# EAGLE design sensor_board012 (EAGLE 5.07)

## Sheet 1 of 2
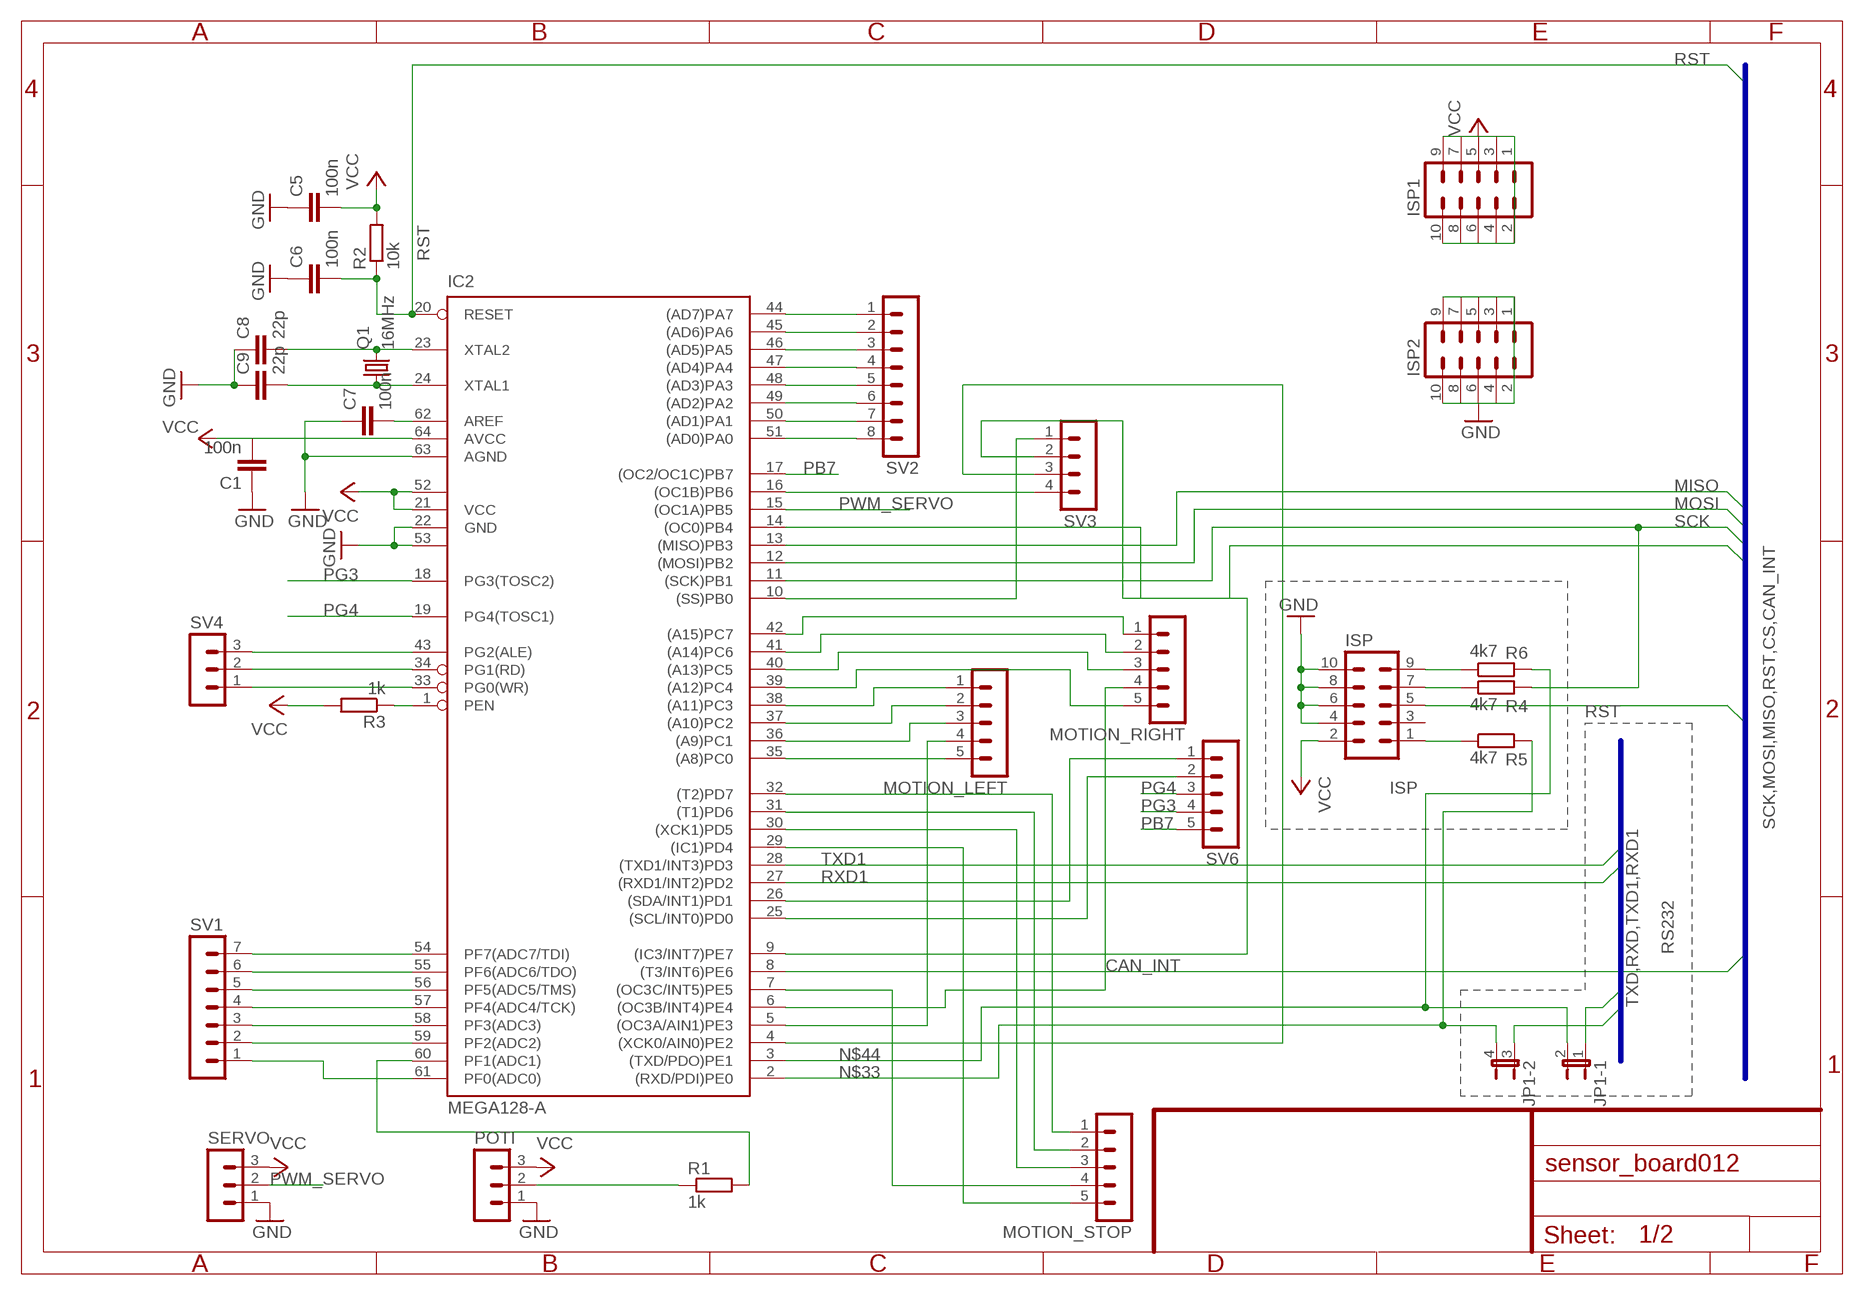
[diagram p0: schematic, sheet 1]

### Parts
C1  100n  C-EUC0603  [C0603]
C5  100n  C-EUC0603  [C0603]
C6  100n  C-EUC0603  [C0603]
C7  100n  C-EUC0603  [C0603]
C8  22p  C-EUC0603  [C0603]
C9  22p  C-EUC0603  [C0603]
IC2  MEGA128-A  [TQFP64]
ISP  MA05-2  [MA05-2]
ISP1  MA05-2  [MA05-2]
ISP2  MA05-2  [MA05-2]
JP1  JP2QE  [JP2Q]
MOTION_LEFT  MA05-1  [MA05-1]
MOTION_RIGHT  MA05-1  [MA05-1]
MOTION_STOP  MA05-1  [MA05-1]
POTI  MA03-1  [MA03-1]
Q1  16MHz  CRYSTALHC49U-V  [HC49U-V]
R1  1k  R-EU_R0805  [R0805]
R2  10k  R-EU_R0805  [R0805]
R3  1k  R-EU_R0805  [R0805]
R4  4k7  R-EU_R0805  [R0805]
R5  4k7  R-EU_R0805  [R0805]
R6  4k7  R-EU_R0805  [R0805]
SERVO  MA03-1  [MA03-1]
SV1  MA07-1  [MA07-1]
SV2  MA08-1  [MA08-1]
SV3  MA04-1  [MA04-1]
SV4  MA03-1  [MA03-1]
SV6  MA05-1  [MA05-1]

### Nets
CAN_INT: IC2.8((T3/INT6)PE6) ; also sheet 2
CS: IC2.14((OC0)PB4) ; also sheet 2
GND: C1.1 C5.1 C6.1 C7.1 C8.1 C9.1 IC2.22(GND) IC2.53(GND1) IC2.63(AGND) ISP2.1 ISP2.2 ISP2.3 ISP2.4 ISP2.5 ISP2.6 ISP2.7 ISP2.8 ISP2.9 ISP2.10 ISP.4 ISP.6 ISP.8 ISP.10 POTI.1 SERVO.1 ; also sheet 2
MISO: IC2.13((MISO)PB3) ; also sheet 2
MOSI: IC2.12((MOSI)PB2) ; also sheet 2
N$1: IC2.54(PF7(ADC7/TDI)) SV1.7
N$3: IC2.35((A8)PC0) MOTION_LEFT.5
N$4: IC2.36((A9)PC1) MOTION_LEFT.3
N$5: C7.2 IC2.62(AREF)
N$6: C9.2 IC2.24(XTAL1) Q1.1
N$7: C8.2 IC2.23(XTAL2) Q1.2
N$9: IC2.37((A10)PC2) MOTION_LEFT.2
N$11: IC2.38((A11)PC3) MOTION_LEFT.1
N$12: IC2.5((OC3A/AIN1)PE3) MOTION_LEFT.4
N$13: IC2.9((IC3/INT7)PE7) SV3.2
N$14: IC2.39((A12)PC4) MOTION_RIGHT.5
N$15: IC2.42((A15)PC7) MOTION_RIGHT.1
N$19: IC2.7((OC3C/INT5)PE5) MOTION_STOP.4
N$20: IC2.44((AD7)PA7) SV2.1
N$22: ISP.9 R6.1
N$24: IC2.45((AD6)PA6) SV2.2
N$25: ISP.1 R5.1
N$26: IC2.1(PEN) R3.1
N$28: IC2.46((AD5)PA5) SV2.3
N$29: ISP.7 R4.1
N$31: IC2.47((AD4)PA4) SV2.4
N$32: IC2.48((AD3)PA3) SV2.5
N$33: IC2.2((RXD/PDI)PE0) JP1.4 R5.2
N$34: IC2.49((AD2)PA2) SV2.6
N$35: IC2.50((AD1)PA1) SV2.7
N$42: IC2.40((A13)PC5) MOTION_RIGHT.3
N$44: IC2.3((TXD/PDO)PE1) JP1.2 R6.2
N$47: IC2.51((AD0)PA0) SV2.8
N$52: IC2.41((A14)PC6) MOTION_RIGHT.2
N$57: IC2.29((IC1)PD4) MOTION_STOP.5
N$58: IC2.55(PF6(ADC6/TDO)) SV1.6
N$60: IC2.56(PF5(ADC5/TMS)) SV1.5
N$61: IC2.25((SCL/INT0)PD0) SV6.2
N$62: IC2.26((SDA/INT1)PD1) SV6.1
N$63: IC2.57(PF4(ADC4/TCK)) SV1.4
N$64: IC2.30((XCK1)PD5) MOTION_STOP.3
N$65: IC2.31((T1)PD6) MOTION_STOP.2
N$66: IC2.32((T2)PD7) MOTION_STOP.1
N$67: IC2.58(PF3(ADC3)) SV1.3
N$68: IC2.59(PF2(ADC2)) SV1.2
N$69: IC2.61(PF0(ADC0)) SV1.1
N$70: IC2.60(PF1(ADC1)) R1.2
N$71: IC2.16((OC1B)PB6) SV3.4
N$72: IC2.10((SS)PB0) SV3.1
N$73: POTI.2 R1.1
N$76: IC2.4((XCK0/AIN0)PE2) SV3.3
N$79: IC2.43(PG2(ALE)) SV4.3
N$80: IC2.34(PG1(RD)) SV4.2
N$81: IC2.33(PG0(WR)) SV4.1
N$82: IC2.6((OC3B/INT4)PE4) MOTION_RIGHT.4
PB7: IC2.17((OC2/OC1C)PB7) SV6.5
PG3: IC2.18(PG3(TOSC2)) SV6.4
PG4: IC2.19(PG4(TOSC1)) SV6.3
PWM_SERVO: IC2.15((OC1A)PB5) SERVO.2
RST: C6.2 IC2.20(RESET) ISP.5 R2.1 ; also sheet 2
RXD: JP1.3 ; also sheet 2
RXD1: IC2.27((RXD1/INT2)PD2) ; also sheet 2
SCK: IC2.11((SCK)PB1) R4.2 ; also sheet 2
TXD: JP1.1 ; also sheet 2
TXD1: IC2.28((TXD1/INT3)PD3) ; also sheet 2
VCC: C1.2 C5.2 IC2.21(VCC) IC2.52(VCC1) IC2.64(AVCC) ISP1.1 ISP1.2 ISP1.3 ISP1.4 ISP1.5 ISP1.6 ISP1.7 ISP1.8 ISP1.9 ISP1.10 ISP.2 POTI.3 R2.2 R3.2 SERVO.3 ; also sheet 2
Unconnected: ISP.3

### Buses
SCK,MOSI,MISO,RST,CS,CAN_INT
TXD,RXD,TXD1,RXD1

### Notes on the sheet
- ISP
- RS232

## Sheet 2 of 2
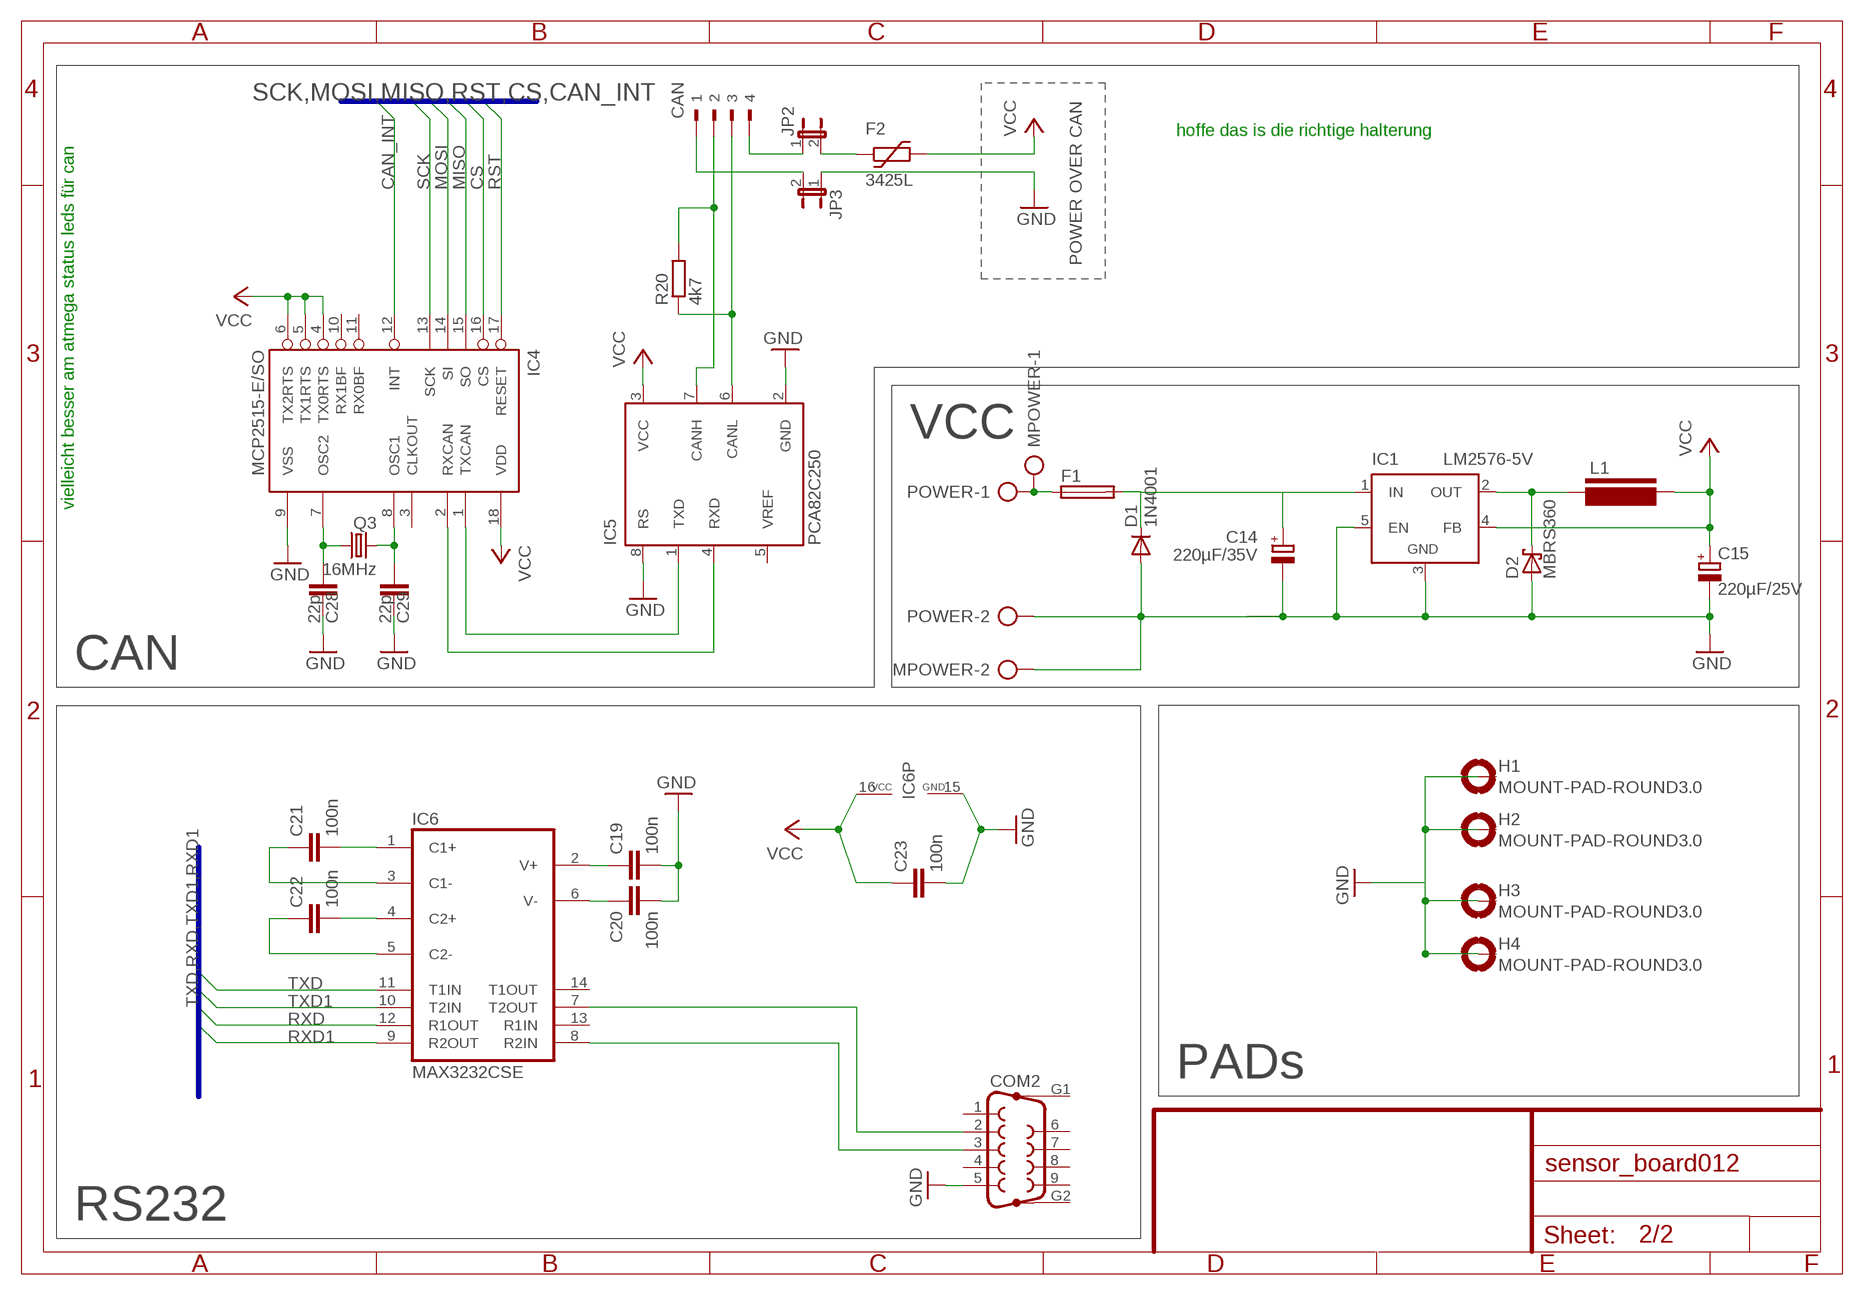
[diagram p1: schematic, sheet 2]

### Parts
C14  220µF/35V  CPOL-EUE5-10.5  [E5-10,5]
C15  220µF/25V  CPOL-EUE3.5-10  [E3,5-10]
C19  100n  C-EUC0603  [C0603]
C20  100n  C-EUC0603  [C0603]
C21  100n  C-EUC0603  [C0603]
C22  100n  C-EUC0603  [C0603]
C23  100n  C-EUC0603  [C0603]
C28  22p  C-EUC0603  [C0603]
C29  22p  C-EUC0603  [C0603]
CAN  90-4  [90-4]
COM2  F09HP  [F09HP]
D1  1N4001  1N4004  [DO41-10]
D2  MBRS360  SCHOTTKY-DIODESMC  [SMC]
F1  SH22,5A  [SH22,5A]
F2  3425L  [3425L]
H1  MOUNT-PAD-ROUND3.0  [3,0-PAD]
H2  MOUNT-PAD-ROUND3.0  [3,0-PAD]
H3  MOUNT-PAD-ROUND3.0  [3,0-PAD]
H4  MOUNT-PAD-ROUND3.0  [3,0-PAD]
IC1  LM2576-5V  LM2596TV  [TO220-51]
IC4  MCP2515-E/SO  [SO18L]
IC5  PCA82C250  [DIL08]
IC6  MAX3232CSE  [SO16]
JP2  JP1E  [JP1]
JP3  JP1E  [JP1]
L1  L-PISR  [PISR]
MPOWER  AK500/2-H  [AK500/2-H]
POWER  AK500/2-H  [AK500/2-H]
Q3  16MHz  CRYSTALHC49U-V  [HC49U-V]
R20  4k7  R-EU_R0805  [R0805]

### Nets
CAN_INT: IC4.12(INT) ; also sheet 1
CS: IC4.16(CS) ; also sheet 1
GND: C14.- C15.- C19.2 C20.2 C23.2 C28.2 C29.2 COM2.5 D1.A D2.A H1.B3,0(MOUNT) H2.B3,0(MOUNT) H3.B3,0(MOUNT) H4.B3,0(MOUNT) IC1.3(GND) IC1.5(EN) IC4.9(VSS) IC5.2(GND) IC5.8(RS) IC6.15(GND) JP3.1 MPOWER.2 POWER.2 ; also sheet 1
MISO: IC4.15(SO) ; also sheet 1
MOSI: IC4.14(SI) ; also sheet 1
N$2: IC4.1(TXCAN) IC5.1(TXD)
N$8 [Power]: D2.C IC1.2(OUT) L1.P$1
N$10 [Power]: F1.1 MPOWER.1 POWER.1
N$16: CAN.4 JP2.1
N$17: C21.2 IC6.1(C1+)
N$21: IC4.2(RXCAN) IC5.4(RXD)
N$23: CAN.3 IC5.6(CANL) R20.1
N$30: C22.2 IC6.4(C2+)
N$36: C22.1 IC6.5(C2-)
N$37: C21.1 IC6.3(C1-)
N$40: COM2.2 IC6.7(T2OUT)
N$41: COM2.3 IC6.8(R2IN)
N$43: C19.1 IC6.2(V+)
N$46: C20.1 IC6.6(V-)
N$49: F2.P$1 JP2.2
N$50: CAN.1 JP3.2
N$53: C28.1 IC4.7(OSC2) Q3.1
N$54: C29.1 IC4.8(OSC1) Q3.2
N$56 [Power]: C14.+ D1.C F1.2 IC1.1(IN)
N$59: CAN.2 IC5.7(CANH) R20.2
RST: IC4.17(RESET) ; also sheet 1
RXD: IC6.12(R1OUT) ; also sheet 1
RXD1: IC6.9(R2OUT) ; also sheet 1
SCK: IC4.13(SCK) ; also sheet 1
TXD: IC6.11(T1IN) ; also sheet 1
TXD1: IC6.10(T2IN) ; also sheet 1
VCC: C15.+ C23.1 F2.P$2 IC1.4(FB) IC4.4(TX0RTS) IC4.5(TX1RTS) IC4.6(TX2RTS) IC4.18(VDD) IC5.3(VCC) IC6.16(VCC) L1.P$2 ; also sheet 1
Unconnected: COM2.1 COM2.4 COM2.6 COM2.7 COM2.8 COM2.9 COM2.G1 COM2.G2 IC4.3(CLKOUT) IC4.10(RX1BF) IC4.11(RX0BF) IC5.5(VREF) IC6.13(R1IN) IC6.14(T1OUT)

### Buses
SCK,MOSI,MISO,RST,CS,CAN_INT
TXD,RXD,TXD1,RXD1

### Notes on the sheet
- POWER OVER CAN
- hoffe das is die richtige halterung
- VCC
- vielleicht besser am atmega status leds für can
- CAN
- PADs
- RS232

## Library data of the parts
C1 C5-C9 C19-C23 C28 C29 = rcl:C-EU: CAPACITOR, European symbol
C14 C15 = rcl:CPOL-EU: POLARIZED CAPACITOR, European symbol
CAN = con-weidmueller-sl35:90-4: WEIDMUELLER CLAMP CONNECTOR
COM2 = con-subd:F09HP: SUB-D
D1 = diode:1N4004: DIODE general purpose rectifier, 1 A
D2 = diode:SCHOTTKY-DIODE: Schottky Diode
F1 = fuse:SH22,5A: FUSE HOLDER grid 22,5mm, isolated cap OGN0031 8201, Schurter (Buerklin)
F2 = ptc-littlefuse:3425L
H1-H4 = holes:MOUNT-PAD-ROUND: MOUNTING PAD, round
IC1 = linear:LM2596T: STEP-DOWN VOLTAGE REGULATOR
IC2 = atmel:MEGA128: MICROCONTROLLER 128 Kbytes FLASH 4 Kbytes SRAM 4 Kbytes EEPROM DUAL USART 8-channel 10 bit ADC Source: avr.lbr
IC4 = mcp2515:MCP2515
IC5 = micro-philips:PCA82C250: CAN CONTROLLER INTERFACE
IC6 = maxim:MAX3232*: True RS-232 Transceivers 3.0V to 5.5V, Low-Power up to 1Mbps, Using Four 0.1µF External Capacitors Source: http://pdfserv.maxim-ic.com/en/ds/MAX3222-MAX3241.pdf
ISP ISP1 ISP2 = con-lstb:MA05-2: PIN HEADER
JP1 = jumper:JP2QE: JUMPER
JP2 JP3 = jumper:JP1E: JUMPER
L1 = L-PISR:L-PISR: Fastron SMD Power Inductors (also Shielded) - PISR Series Data Sheet <http://www.fastrongroup.com/products/inductors/pdf/PISR.pdf> Part No Inductance L (µH) fL (MHz) Tol ± (%) SRF min (MHz) DCR max (Ω) Rated DC Current | sat (A) | Δ T = 40°C (A) PISR-1R0M-04 1.0 0.1 20 164 0.009 21 8.60 PISR-2R2M-04 2.2 0.1 20 95 0.014 16 7.10 PISR-3R3M-04 3.3 0.1 20 72 0.017 15 6.40 PISR-4R7M-04 4.7 0.1 20 52 0.019 13 5.80 PISR-5R6M-04 5.6 0.1 20 41 0.022 12 5.50 PISR-6R8M-04 6.8 0.1 20 35 0.024 11 5.20 PISR-100M-04 10 0.1 20 24 0.029 10 4.50 PISR-150M-04 15 0.1 20 20 0.035 8.0 4.10 PISR-220M-04 22 0.1 20 15 0.04 7.0 3.60 PISR-330M-04 33 0.1 20 10 0.06 5.6 3.10 PISR-470M-04 47 0.1 20 8 0.07 4.6 2.70 PISR-680M-04 68 0.1 20 6.5 0.10 3.6 2.30 PISR-101M-04 100 0.1 20 5.2 0.17 3.1 1.90 PISR-151M-04 150 0.1 20 4.2 0.22 2.6 1.60 PISR-221M-04 220 0.1 20 3.3 0.34 2.2 1.30 PISR-331M-04 330 0.1 20 2.7 0.52 1.9 1.10 PISR-471M-04 470 0.1 20 2.1 0.76 1.4 0.85 PISR-681M-04 680 0.1 20 1.8 1.1 1.2 0.74 PISR-102M-04 1000 0.1 20 1.3 1.7 1.0 0.57
MOTION_LEFT MOTION_RIGHT MOTION_STOP SV6 = con-lstb:MA05-1: PIN HEADER
MPOWER POWER = con-ptr500:AK500/2-H: CONNECTOR Aug. 2004 / PTR Meßtechnik: Die Bezeichnung der Serie AK505 wurde geändert. Es handelt sich hierbei um AK500 in horizontaler Ausführung.
POTI SERVO SV4 = con-lstb:MA03-1: PIN HEADER
Q1 Q3 = crystal:CRYSTAL: CRYSTAL
R1-R6 R20 = rcl:R-EU_: RESISTOR, European symbol
SV1 = con-lstb:MA07-1: PIN HEADER
SV2 = con-lstb:MA08-1: PIN HEADER
SV3 = con-lstb:MA04-1: PIN HEADER

## Net classes
1 Power: width 0.406 mm

## Board
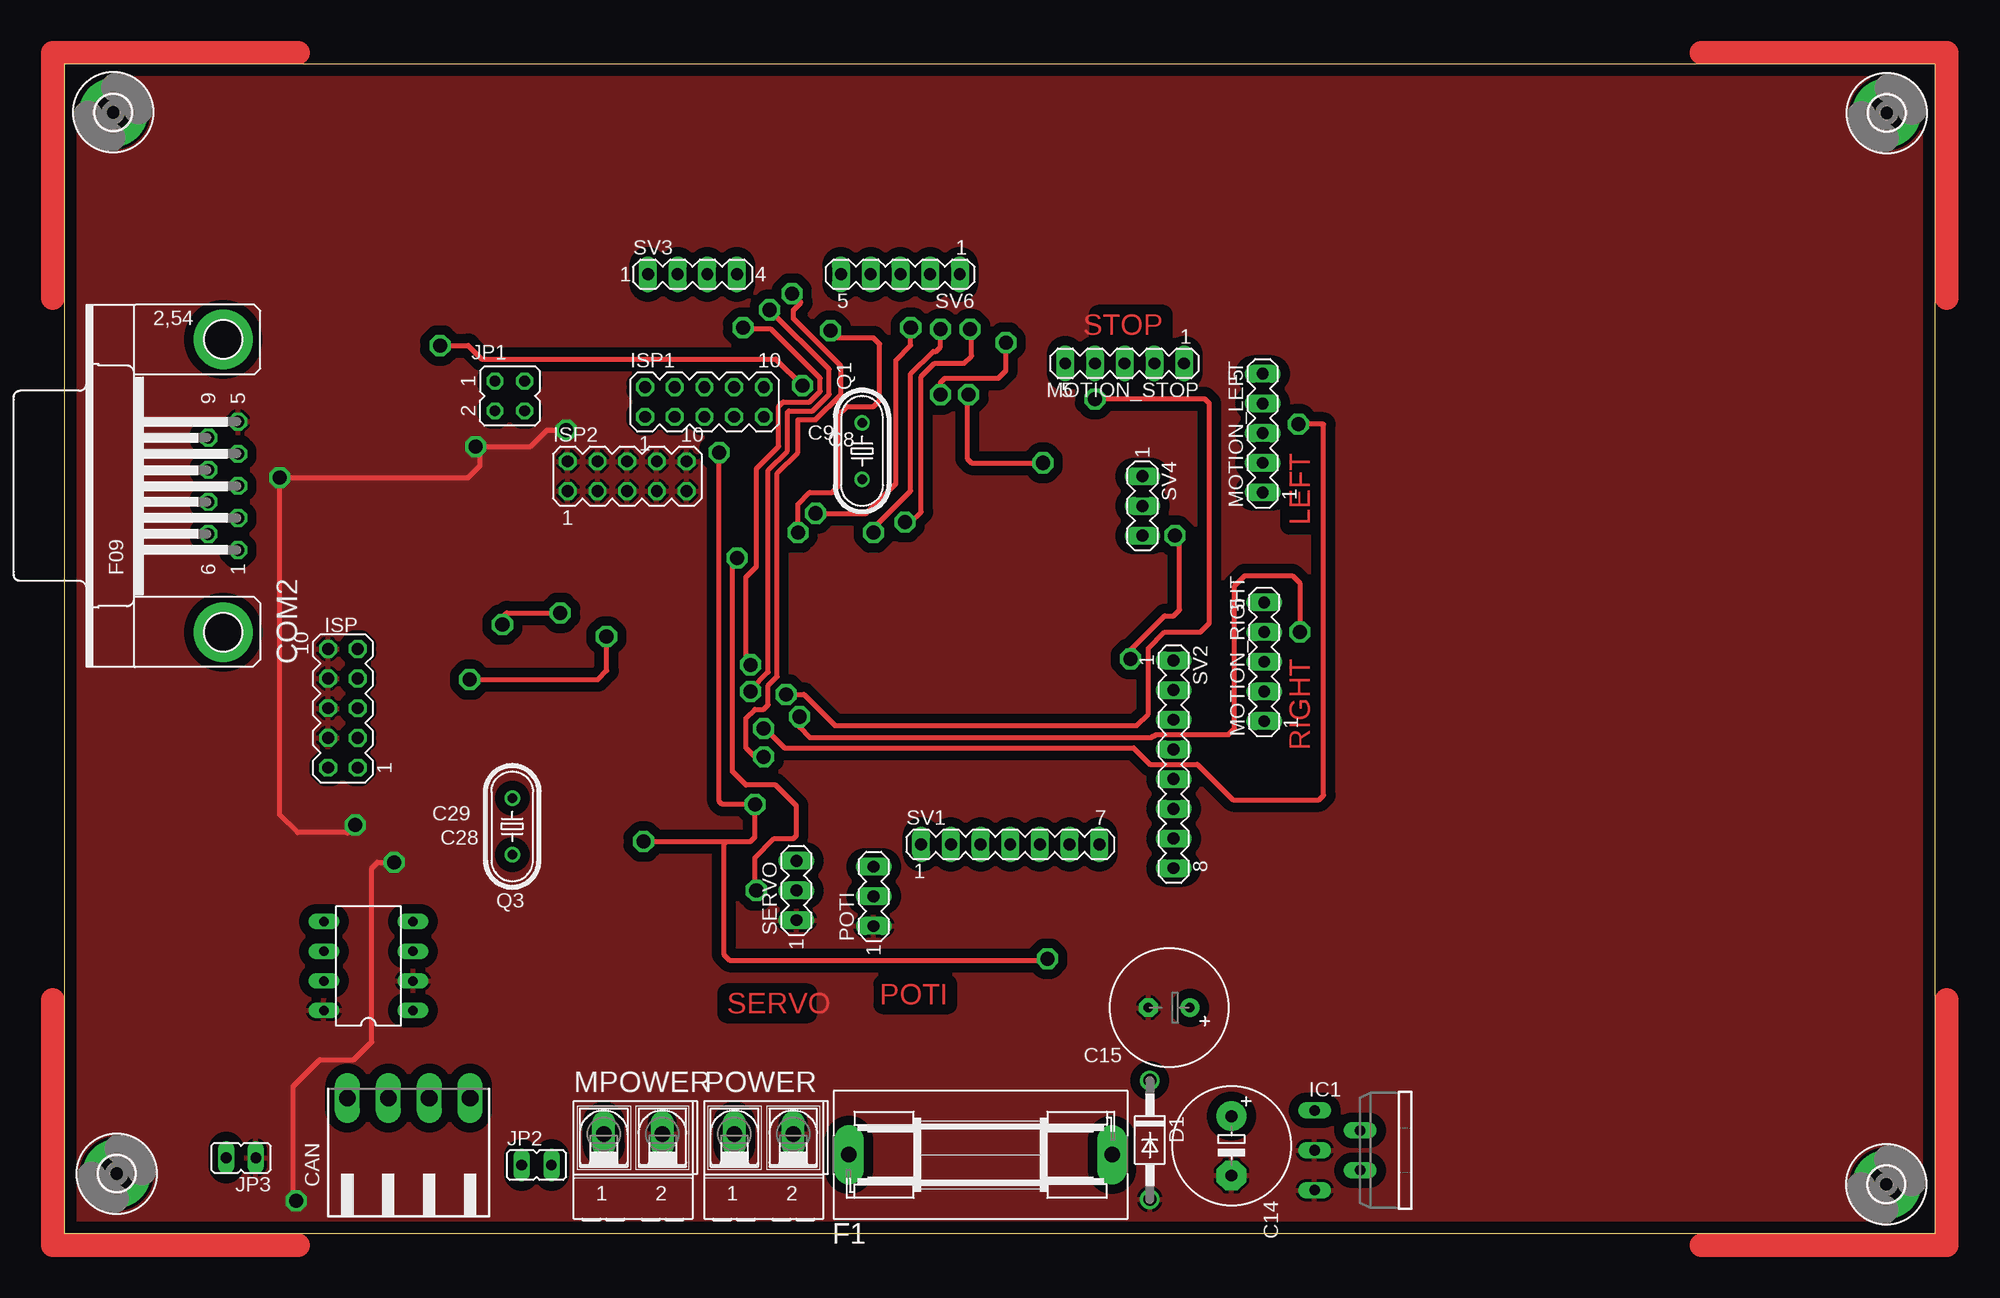
[diagram p2: board, top side]
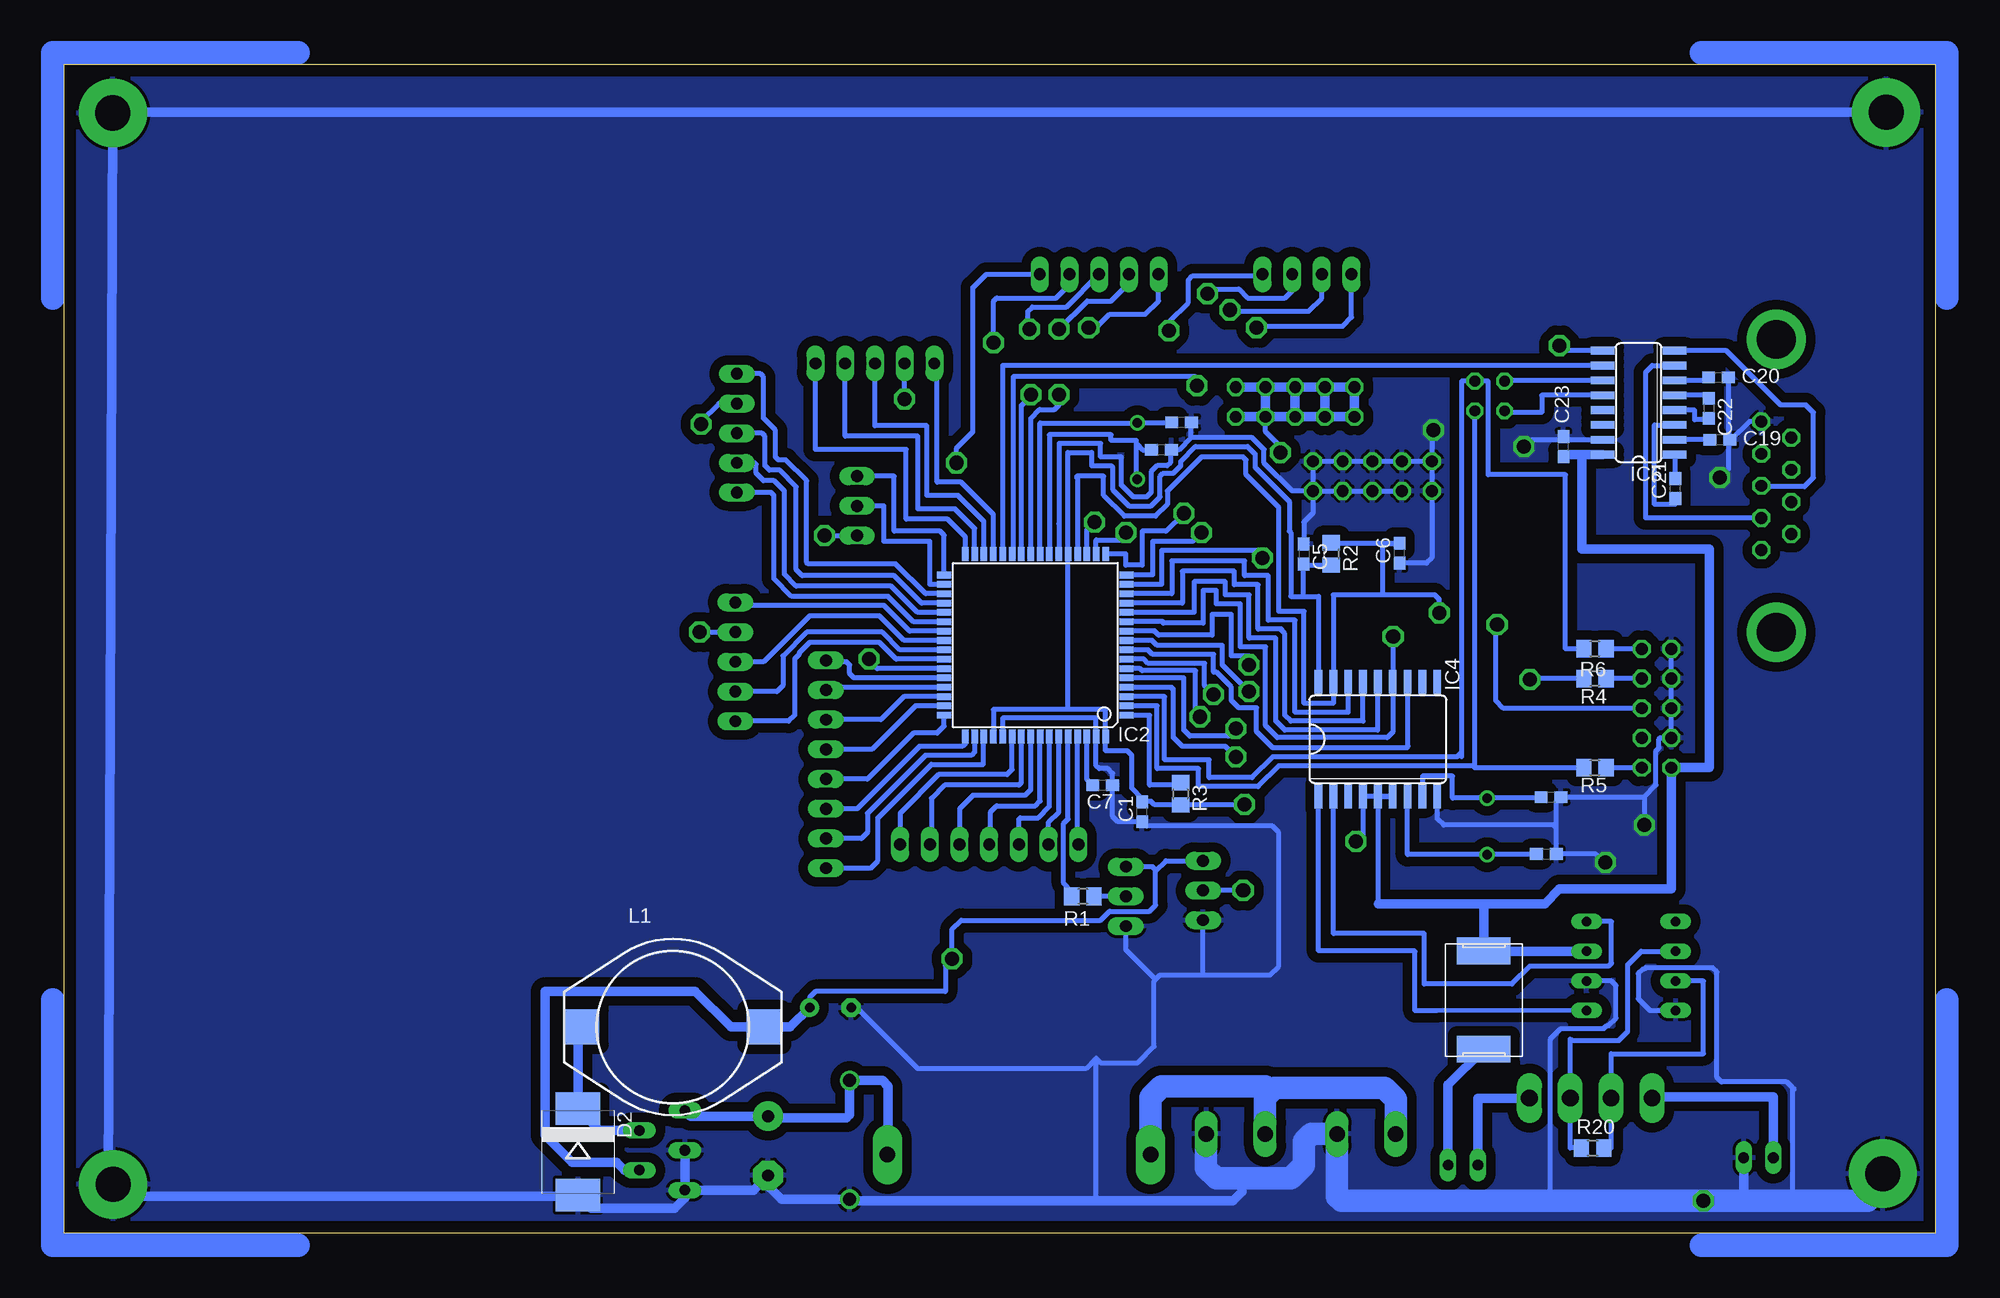
[diagram p3: board, bottom side, seen from below]

Size 160 x 100 mm. Coordinates in mm from the lower left corner, seen from the top.
Outline: 0,0 160,0 160,100 0,100 0,0
Copper layers (1*16): Top 0.035mm / dielectric 1.5mm / Bottom 0.035mm
Design rules "default": minimum track width 10mil, minimum drill 24mil, track to track 8mil, track to pad 8mil, pad to pad 8mil, via to via 8mil, smd to smd 8mil, copper to edge 40mil, drill to drill 8mil, minimum pad ring 10mil, minimum via ring 8mil, stop-mask expansion 4mil, vias tented up to drill 0mil, thermal gap 10mil

### Footprints (pad centres in the part's own frame; a part is rotated, then mirrored left to right if it is on the bottom)
C0603 = smd 1.1 x 1: 1 -0.85,0; 2 0.85,0
E5-10,5 = drill 1.016 pad 2.54 round: + -2.54,0 | drill 1.016 pad 2.54 octagon: - 2.54,0
E3,5-10 = drill 0.813 pad 1.6 round: + -1.778,0 | drill 0.813 pad 1.6 octagon: - 1.778,0
90-4 = drill 1.422 long: 1 -5.25,5.25; 2 -1.75,5.25; 3 1.75,5.25; 4 5.25,5.25
F09HP = drill 1.016 octagon: 1 -5.486,-1.27; 2 -2.743,-1.27; 3 0,-1.27; 4 2.743,-1.27; 5 5.486,-1.27; 6 -4.115,1.27; 7 -1.372,1.27; 8 1.372,1.27; 9 4.115,1.27 | drill 3.302 pad 5.08 round: G1 -12.522,0; G2 12.522,0
DO41-10 = drill 1.118 round: A 5.08,0; C -5.08,0
SMC = smd 2.8 x 3.8: A 3.7,0; C -3.7,0
SH22,5A = drill 1.321 pad 2.54 long: 1 -11.252,0; 2 11.252,0
3425L = smd 2.29 x 4.57: P$1 -4.2,0; P$2 4.2,0
3,0-PAD = drill 3 pad 5.842 round: B3,0 0,0
TO220-51 = drill 0.9 long: 1 -3.4,-8.4; 2 -1.7,-4.5; 3 0,-8.4; 4 1.7,-4.5; 5 3.4,-8.4
TQFP64 = smd 1.194 x 0.559: 1 -7.8,6; 2 -7.8,5.2; 3 -7.8,4.4; 4 -7.8,3.6; 5 -7.8,2.8; 6 -7.8,2; 7 -7.8,1.2; 8 -7.8,0.4; 9 -7.8,-0.4; 10 -7.8,-1.2; 11 -7.8,-2; 12 -7.8,-2.8; 13 -7.8,-3.6; 14 -7.8,-4.4; 15 -7.8,-5.2; 16 -7.8,-6; 33 7.8,-6; 34 7.8,-5.2; 35 7.8,-4.4; 36 7.8,-3.6; 37 7.8,-2.8; 38 7.8,-2; 39 7.8,-1.2; 40 7.8,-0.4; 41 7.8,0.4; 42 7.8,1.2; 43 7.8,2; 44 7.8,2.8; 45 7.8,3.6; 46 7.8,4.4; 47 7.8,5.2; 48 7.8,6 | smd 0.559 x 1.194: 17 -6,-7.8; 18 -5.2,-7.8; 19 -4.4,-7.8; 20 -3.6,-7.8; 21 -2.8,-7.8; 22 -2,-7.8; 23 -1.2,-7.8; 24 -0.4,-7.8; 25 0.4,-7.8; 26 1.2,-7.8; 27 2,-7.8; 28 2.8,-7.8; 29 3.6,-7.8; 30 4.4,-7.8; 31 5.2,-7.8; 32 6,-7.8; 49 6,7.8; 50 5.2,7.8; 51 4.4,7.8; 52 3.6,7.8; 53 2.8,7.8; 54 2,7.8; 55 1.2,7.8; 56 0.4,7.8; 57 -0.4,7.8; 58 -1.2,7.8; 59 -2,7.8; 60 -2.8,7.8; 61 -3.6,7.8; 62 -4.4,7.8; 63 -5.2,7.8; 64 -6,7.8
SO18L = smd 0.66 x 2.032: 1 -5.08,-4.902; 2 -3.81,-4.902; 3 -2.54,-4.902; 4 -1.27,-4.902; 5 0,-4.902; 6 1.27,-4.902; 7 2.54,-4.902; 8 3.81,-4.902; 9 5.08,-4.902; 10 5.08,4.902; 11 3.81,4.902; 12 2.54,4.902; 13 1.27,4.902; 14 0,4.902; 15 -1.27,4.902; 16 -2.54,4.902; 17 -3.81,4.902; 18 -5.08,4.902
DIL08 = drill 0.813 long: 1 -3.81,-3.81; 2 -1.27,-3.81; 3 1.27,-3.81; 4 3.81,-3.81; 5 3.81,3.81; 6 1.27,3.81; 7 -1.27,3.81; 8 -3.81,3.81
SO16 = smd 0.66 x 2.032: 1 -4.445,-3.073; 2 -3.175,-3.073; 3 -1.905,-3.073; 4 -0.635,-3.073; 5 0.635,-3.073; 6 1.905,-3.073; 7 3.175,-3.073; 8 4.445,-3.073; 9 4.445,3.073; 10 3.175,3.073; 11 1.905,3.073; 12 0.635,3.073; 13 -0.635,3.073; 14 -1.905,3.073; 15 -3.175,3.073; 16 -4.445,3.073
MA05-2 = drill 1.016 octagon: 1 -5.08,-1.27; 2 -5.08,1.27; 3 -2.54,-1.27; 4 -2.54,1.27; 5 0,-1.27; 6 0,1.27; 7 2.54,-1.27; 8 2.54,1.27; 9 5.08,-1.27; 10 5.08,1.27
JP2Q = drill 0.914 octagon: 1 -1.27,-1.27; 2 -1.27,1.27; 3 1.27,-1.27; 4 1.27,1.27
JP1 = drill 0.914 long: 1 0,-1.27; 2 0,1.27
PISR = smd 3 x 3: P$1 -7.8,0; P$2 7.8,0
MA05-1 = drill 1.016 long: 1 -5.08,0; 2 -2.54,0; 3 0,0; 4 2.54,0; 5 5.08,0
AK500/2-H = drill 1.321 long: 1 -2.515,0; 2 2.515,0
MA03-1 = drill 1.016 long: 1 -2.54,0; 2 0,0; 3 2.54,0
HC49U-V = drill 0.813 round: 1 -2.413,0; 2 2.413,0
R0805 = smd 1.3 x 1.5: 1 -0.95,0; 2 0.95,0
MA07-1 = drill 1.016 long: 1 -7.62,0; 2 -5.08,0; 3 -2.54,0; 4 0,0; 5 2.54,0; 6 5.08,0; 7 7.62,0
MA08-1 = drill 1.016 long: 1 -8.89,0; 2 -6.35,0; 3 -3.81,0; 4 -1.27,0; 5 1.27,0; 6 3.81,0; 7 6.35,0; 8 8.89,0
MA04-1 = drill 1.016 long: 1 -3.81,0; 2 -1.27,0; 3 1.27,0; 4 3.81,0

### Placement (x,y rotation side)
C1  67.82,36.07 90 bottom
C5  54,58.12 270 bottom
C6  45.81,58.18 90 bottom
C7  71.2,38.33 180 bottom
C8  66.18,67.02 180 bottom
C9  64.44,69.38 180 bottom
C14  99.82,7.49 270 top
C15  94.49,19.3 180 top
C19  18.41,67.88 0 bottom
C20  18.53,73.22 0 bottom
C21  22.23,63.72 90 bottom
C22  19.37,70.57 270 bottom
C23  31.79,67.31 90 bottom
C28  33.25,32.46 0 bottom
C29  32.85,37.33 0 bottom
CAN  29.45,6.32 0 top
COM2  13.59,63.94 90 top
D1  92.84,8 270 top
D2  116.08,6.99 270 bottom
F1  78.36,6.73 0 top
F2  38.61,19.96 90 bottom
H1  4.48,5.12 0 top
H2  155.85,95.84 0 top
H3  155.83,4.19 0 top
H4  4.19,95.89 0 top
IC1  115.32,7.11 270 top
IC2  76.95,50.32 180 bottom
IC4  47.66,42.28 0 bottom
IC5  26.01,22.87 90 top
IC6  25.36,71.06 90 bottom
ISP  23.83,44.92 90 top
ISP1  54.74,71.12 0 top
ISP2  48.13,64.77 0 top
JP1  38.1,71.63 270 top
JP2  40.39,5.84 270 top
JP3  15.11,6.48 90 top
L1  107.95,17.65 0 bottom
MOTION_LEFT  102.49,68.45 90 top
MOTION_RIGHT  102.62,48.9 90 top
MOTION_STOP  90.68,74.42 180 top
MPOWER  48.64,8.51 0 top
POTI  69.22,28.83 90 top
POWER  59.82,8.51 0 top
Q1  68.22,66.92 270 top
Q3  38.3,34.82 90 top
R1  72.9,28.83 180 bottom
R2  51.65,58.12 270 bottom
R3  64.54,37.6 270 bottom
R4  29.1,47.45 180 bottom
R5  29.1,39.83 180 bottom
R6  29.1,50 180 bottom
R20  29.3,7.32 0 bottom
SERVO  62.61,29.34 90 top
SV1  80.9,33.27 0 top
SV2  94.87,40.13 270 top
SV3  53.72,82.04 0 top
SV4  92.2,62.23 270 top
SV6  71.5,82.04 180 top

### Tracks (layer width: path | path; a pad name or v marks a point on that pad's centre or on a via)
CAN_INT
  Bottom 0.406: IC4.12 45.09,47.18 45.09,41.66 45.21,41.53 56.64,41.53 56.77,41.66 57.02,41.91 58.04,42.93 58.04,44.96 59.56,44.96 60.2,45.59 60.2,46.74 61.47,48.01 61.72,48.01 61.72,49.53 66.93,49.53 67.32,49.92 IC2.8
CS
  Bottom 0.406: IC4.16 50.2,44.58 54.74,44.58 54.74,52.45 57.02,52.45 57.02,56.26 59.05,56.26 59.05,57.53 65.28,57.53 65.28,54.72 IC2.14
GND  (via drill 1.2, 1.2 pad 1.78)
  Top 0.406: v24.89,34.92 24.19,34.23 24.13,34.29 19.94,34.29 18.41,35.81 v18.41,64.64 34.54,64.64 35.56,65.66 35.56,66.93 v35.18,67.31 39.88,67.31 41.27,68.71 v42.93,68.71 | v28.19,31.75 26.8,31.75 26.29,31.24 26.29,16.38 24.77,14.86 21.84,14.86 19.56,12.57 19.56,3.05 v19.81,2.79
  Bottom 0.406: C20.2 17.65,73.22 17.65,67.88 | 17.65,67.88 C19.2 17.46,67.88 15.88,69.47 14.9,69.47 COM2.5 | C23.2 31.75,68.16 31.75,67.88 | 31.75,67.88 IC6.15 | C5.1 54,60.83 53.21,61.62 ISP2.9 | IC2.22 74.95,60.69 74.93,60.69 74.93,67.56 71.37,67.56 71.37,66.42 69.6,66.42 69.6,64.01 68.58,62.99 67.44,62.99 67.06,63.37 67.06,65.15 66.55,65.66 65.66,65.66 65.41,65.91 65.41,66.94 C8.1 64.68,67.02 63.63,68.07 | IC2.53 79.76,44.07 71.75,44.07 IC2.63 71.75,40.01 71.5,39.75 70.74,39.75 70.35,39.36 C7.1 70.36,38.32 70.36,35.69 69.89,35.22 C1.1 67.44,34.84 56.68,34.84 56.13,34.29 56.13,22.86 56.9,22.1 62.61,22.1 | C15.- 92.2,19.3 87,14.1 72.64,14.1 71.75,14.99 | IC5.8 24.4,19.06 25.4,20.07 25.4,22.23 25.02,22.61 24.89,22.61 24.77,22.73 19.05,22.73 18.67,22.35 18.67,13.34 18.29,12.95 12.7,12.95 12.19,12.45 | 12.19,12.45 12.19,2.92 12.32,2.79 | 32.4,34.67 32.4,36.93 C29.2 24.89,37.34 | 32.4,34.67 C28.2 29.03,32.46 28.32,31.75 v28.19,31.75 | 71.75,14.99 71.75,3.17 72.14,2.79 | 62.61,22.1 66.29,22.1 66.67,21.72 | 66.67,21.72 66.8,21.59 66.8,16 68.2,14.61 71.37,14.61 71.75,14.99 | ISP2.2 ISP2.1 43.05,57.78 43.51,57.33 C6.1 | ISP2.2 ISP2.4 ISP2.6 ISP2.8 ISP2.10 ISP2.9 | ISP2.9 ISP2.7 ISP2.5 ISP2.3 | ISP.10 ISP.8 ISP.6 ISP.4 23.53,42.38 23.62,42.29 23.62,41.53 23.88,41.27 23.88,38.35 24.89,37.34 | 12.19,12.45 12.06,12.32 | 24.89,37.34 v24.89,34.92 | 31.75,67.88 34.61,67.88 v35.18,67.31 | ISP2.2 43.05,68.58 v42.93,68.71 | 17.65,67.88 17.65,65.41 v18.41,64.64 | IC4.9 42.58,35.47 42.04,34.92 32.65,34.92 32.4,34.67 | 92.84,2.79 D1.A | IC5.2 27.7,21.6 27.3,21.21 27.3,18.41 27.94,17.78 28.07,17.78 28.32,17.53 32,17.53 32.89,16.64 32.89,3.05 33.15,2.79
  Bottom 0.406: POTI.1 69.22,24.26 66.67,21.72 | 62.61,22.1 SERVO.1 | 63.63,68.07 63.63,69.34 C9.1 | 63.63,68.07 58.42,68.07 57.4,67.06 57.4,65.91 54.99,63.5 ISP2.9
  Bottom 0.813: JP3.1 16.38,3.05 16.13,2.79 | D1.A 98.68,2.92 99.69,3.94 99.69,4.83 C14.- 101.06,3.71 IC1.5 | 92.84,2.79 72.14,2.79 60.07,2.79 59.31,3.56 59.31,4.19 | 59.31,4.19 59.18,4.32 | 59.31,4.19 60.58,4.19 61.09,4.7 | IC1.5 IC1.3 | IC1.5 106.92,3.07 107.82,2.16 114.95,2.16 D2.A 116.98,3.29 117.09,3.17 155.83,3.17 | H4.B3,0 156.84,95.89 156.97,95.76 156.56,95.76 H2.B3,0 156.23,3.3 | 155.83,3.17 H3.B3,0 | 156.23,3.3 156.23,3.15 156.34,3.05 | 155.83,3.17 156.1,3.17 156.23,3.3
  Bottom 1.93: POWER.2 62.36,8.48 62.36,5.59 61.47,4.7 61.09,4.7 55.12,4.7 53.98,5.84 53.98,7.87 53.34,8.51 MPOWER.2 51.16,3.15 50.8,2.79 33.15,2.79 v19.81,2.79 16.13,2.79 12.32,2.79 5.79,2.79 H1.B3,0
  pour Bottom (isolate 0.813): -0.25,100.08 160.02,100.08 160.15,0 -0.13,-0.25
  pour Top (isolate 0.813): -0.13,100.08 160.15,100.08 160.15,0 -0.13,-0.25
MISO
  Bottom 0.406: IC4.15 48.93,43.81 55.12,43.81 55.63,44.32 55.63,51.31 55.88,51.56 55.88,51.69 57.91,51.69 57.91,55.5 59.94,55.5 59.94,56.64 64.39,56.64 64.39,53.92 IC2.13
MOSI
  Bottom 0.406: IC4.14 47.66,43.05 55.63,43.05 56.39,43.81 56.39,50.93 58.67,50.93 58.67,54.61 60.71,54.61 60.71,55.75 63.37,55.75 63.37,53.12 IC2.12
N$1
  Bottom 0.406: IC2.54 78.95,39.67 79.38,39.24 85.22,39.24 88.52,35.94 SV1.7
N$2
  Bottom 0.406: IC5.1 42.65,19.05 44.49,19.05 44.49,24.09 44.58,24.18 52.74,24.18 IC4.1
N$3
  Bottom 0.406: IC2.35 86.34,54.72 88.9,57.28 96.39,57.28 96.52,57.4 96.52,64.39 98.3,66.17 98.93,66.17 99.19,66.42 99.19,68.71 100.2,69.72 100.2,73.28 100.46,73.53 MOTION_LEFT.5
N$4
  Bottom 0.406: IC2.36 86.68,53.92 89.03,56.26 96.9,56.26 97.41,56.77 97.41,63.88 98.81,65.28 99.69,65.28 100.08,65.66 100.08,68.2 100.33,68.45 MOTION_LEFT.3
N$5
  Bottom 0.406: IC2.62 72.55,38.83 C7.2
N$6
  Bottom 0.406: Q1.1 68.2,69.34 | 65.29,69.34 65.15,69.34 | 65.29,69.34 C9.2 | Q1.1 68.22,69.34 65.29,69.34 | Q1.1 76.55,69.33 IC2.24
N$7
  Bottom 0.406: 68.22,64.52 Q1.2 68.2,64.52 68.22,64.52 | 68.22,64.52 68.33,64.52 68.33,67.56 | 68.33,67.56 68.33,67.82 70.48,67.82 70.48,68.33 75.75,68.33 IC2.23 | C8.2 67.78,67.02 68.33,67.56
N$8
  Bottom 0.813: IC1.2 114.2,8.81 D2.C 116.08,17.32 L1.P$1
N$9
  Bottom 0.406: IC2.37 87.03,53.12 89.28,55.37 97.41,55.37 98.42,56.39 98.42,63.5 99.31,64.39 100.2,64.39 100.84,65.02 100.84,65.79 100.97,65.91 MOTION_LEFT.2
N$10
  Bottom 1.93: MPOWER.1 46.13,11.46 47.12,12.45 56.52,12.45 56.83,12.13 | POWER.1 57.3,11.66 56.83,12.13 | F1.1 67.11,11.63 66.17,12.57 57.28,12.57 56.83,12.13
N$11
  Bottom 0.406: IC2.38 87.37,52.32 89.53,54.48 97.79,54.48 99.31,56.01 99.31,63.12 99.57,63.37 MOTION_LEFT.1
N$12  (via drill 1.2 pad 1.78)
  Top 0.406: v59.82,43.18 59.94,43.18 61.59,41.53 91.44,41.53 92.84,40.13 96.9,40.13 99.95,37.08 107.31,37.08 107.7,37.47 107.7,69.22 v105.54,69.22
  Bottom 0.406: IC2.5 64.26,47.52 64.26,43.05 63.75,42.55 60.45,42.55 v59.82,43.18 | v105.54,69.22 105.54,69.47 104.01,70.99 MOTION_LEFT.4
N$13  (via drill 1.2 pad 1.78)
  Top 0.406: v58.67,46.35 58.67,46.48 60.2,48.01 60.2,65.28 61.85,66.93 61.85,70.23 61.98,70.36 64.01,70.36 65.41,71.75 65.41,73.91 v60.33,78.99
  Bottom 0.406: IC2.9 66.97,50.72 66.55,50.29 60.96,50.29 60.96,48.64 v58.67,46.35 | SV3.2 52.45,80.01 53.59,78.87 60.2,78.87 v60.33,78.99
N$14
  Bottom 0.406: IC2.39 87.71,51.52 89.92,53.72 102.36,53.72 MOTION_RIGHT.5
N$15
  Bottom 0.406: IC2.42 88.87,49.12 90.3,50.55 96.27,50.55 97.16,49.66 97.16,49.53 97.54,49.15 97.54,44.32 98.04,43.81 MOTION_RIGHT.1
N$16
  Bottom 0.813: JP2.1 39.12,11.56 34.7,11.56 CAN.4
N$17
  Bottom 0.406: IC6.1 22.23,66.61 C21.2
N$18
  Top 2: 20,-1 -1,-1 -1,20
N$19  (via drill 1.2 pad 1.78)
  Top 0.406: v61.72,46.1 63.25,46.1 65.91,43.43 91.69,43.43 92.71,44.45 92.71,50.04 94.11,51.44 97.16,51.44 97.92,52.2 97.92,70.99 97.54,71.37 v88.14,71.37
  Bottom 0.406: IC2.7 67.66,49.12 67.31,48.77 62.48,48.77 62.48,46.86 v61.72,46.1 | v88.14,71.37 MOTION_STOP.4
N$20
  Bottom 0.406: IC2.44 92.47,47.52 92.84,47.88 92.84,48.64 93.09,48.9 94.74,48.9 SV2.1
N$21
  Bottom 0.406: IC5.4 27.69,26.68 27.69,23.11 27.94,22.86 34.67,22.86 36.2,21.34 43.69,21.34 43.69,25.65 51.44,25.65 51.47,25.69 IC4.2
N$22
  Bottom 0.406: ISP.9 R6.1
N$23
  Bottom 0.406: R20.1 31.2,7.32 CAN.3 31.2,16.64 31.07,16.51 27.05,16.51 26.29,17.27 26.29,22.99 25.13,24.14 IC5.6
N$24
  Bottom 0.406: IC2.45 94.63,46.72 SV2.2
N$25
  Bottom 0.406: R5.1 25.09,39.83 ISP.1
N$26
  Bottom 0.406: IC2.1 67.18,44.32 67.18,38.35 64.54,38.35 R3.1
N$27
  Top 2: 140,-1 161,-1 161,20
N$28
  Bottom 0.406: IC2.46 88.19,45.92 90.17,43.94 SV2.3
N$29
  Bottom 0.406: ISP.7 R4.1
N$30
  Bottom 0.406: IC6.4 20.57,70.42 20.57,69.6 19.43,69.6 19.43,69.72 C22.2
N$31
  Bottom 0.406: IC2.47 87.22,45.12 90.93,41.4 SV2.4
N$32
  Bottom 0.406: IC2.48 84.75,43.39 85.34,42.8 87.38,42.8 91.31,38.86 SV2.5
N$33
  Bottom 0.406: R5.2 39.37,39.83 39.37,39.88 39.37,40.01 | IC2.2 66.55,45.12 66.55,39.75 62.99,39.75 62.99,38.23 57.91,38.23 56.13,40.01 39.37,40.01 | 39.37,40.01 JP1.4
N$34
  Bottom 0.406: IC2.49 82.95,41.89 83.19,41.66 86.87,41.66 92.2,36.32 SV2.6
N$35
  Bottom 0.406: IC2.50 82.15,41.17 82.42,40.89 86.36,40.89 91.31,35.94 91.31,34.29 91.82,33.78 SV2.7
N$36
  Bottom 0.406: C22.1 19.43,71.42 19.43,71.69 IC6.5
N$37
  Bottom 0.406: IC6.3 24,69.15 24,62.36 22.23,62.36 C21.1
N$38
  Top 2: 20,101 -1,101 -1,80
N$39
  Top 2: 161,80 161,101 140,101
N$40
  Bottom 0.406: IC6.7 24.19,74.23 24.77,73.66 24.77,61.2 COM2.2
N$41
  Bottom 0.406: IC6.8 17.84,75.5 13.21,70.87 11.05,70.87 10.41,70.23 10.41,64.64 11.18,63.88 14.8,63.88 COM2.3
N$42
  Bottom 0.406: IC2.40 88.18,50.72 90.3,52.83 96.27,52.83 100.2,48.9 MOTION_RIGHT.3
N$43
  Bottom 0.406: IC6.2 C19.1 19.18,67.88 19.18,67.94
N$44
  Bottom 0.406: R6.2 31.62,50 31.62,64.9 38.23,64.9 38.23,72.9 JP1.2 40.51,72.9 40.51,41.15 | IC2.3 65.91,45.92 65.91,40.51 62.1,40.51 62.1,38.99 58.42,38.99 56.64,40.77 40.89,40.77 40.51,41.15 | 40.51,41.15 40.51,40.77
N$45
  Bottom 2: 140,-1 161,-1 161,20
N$46
  Bottom 0.406: C20.1 19.43,73.22 19.43,72.96 IC6.6
N$47
  Bottom 0.406: IC2.51 81.41,42.52 81.41,40.13 85.85,40.13 90.42,35.56 90.42,31.88 91.06,31.24 SV2.8
N$48
  Bottom 2: 20,101 -1,101 -1,80
N$49
  Bottom 0.813: JP2.2 41.66,12.72 F2.P$1
N$50
  Bottom 0.813: JP3.2 13.84,11.68 24.2,11.68 CAN.1
N$51
  Bottom 2: 161,80 161,101 140,101
N$52
  Bottom 0.406: IC2.41 88.53,49.92 90.04,51.44 96.52,51.44 98.55,49.4 98.55,46.86 99.06,46.35 MOTION_RIGHT.2
N$53
  Bottom 0.406: Q3.1 38.28,32.44 | Q3.1 45.12,32.41 IC4.7 | C28.1 34.15,32.41 Q3.1
N$54
  Bottom 0.406: Q3.2 38.29,37.22 | Q3.2 41.27,37.24 41.27,39.12 43.85,39.12 IC4.8 | C29.1 33.79,37.24 Q3.2
N$55
  Bottom 2: 20,-1 -1,-1 -1,20
N$56
  Bottom 0.813: F1.2 89.53,6.81 89.53,12.57 90.04,13.08 D1.C 92.84,10.16 93.09,9.91 99.69,9.91 C14.+ 106.44,10.03 IC1.1
N$57
  Bottom 0.406: IC2.29 80.55,61.5 83.31,64.26 85.34,64.26 85.34,74.17 MOTION_STOP.5
N$58
  Bottom 0.406: IC2.55 78.15,38.56 78.36,38.35 84.71,38.35 85.85,37.21 85.85,33.4 SV1.6
N$59
  Bottom 0.406: IC5.7 19.81,21.6 19.81,15.37 27.7,15.37 CAN.2 27.7,7.32 R20.2
N$60
  Bottom 0.406: IC2.56 77.35,37.97 77.85,37.47 82.3,37.47 83.44,36.32 SV1.5
N$61  (via drill 1.2 pad 1.78)
  Top 0.406: v80.52,76.2 80.52,73.79 79.88,73.15 75.31,73.15 74.93,72.77 v74.93,71.75
  Bottom 0.406: IC2.25 77.35,69.72 76.58,70.48 75.31,70.48 74.93,70.87 v74.93,71.75 | SV6.2 74.04,81.15 75.18,80.01 80.26,80.01 80.52,79.76 v80.52,76.2
N$62  (via drill 1.2 pad 1.78)
  Top 0.406: 83.82,65.79 v83.69,65.91 77.6,65.91 77.22,66.29 77.22,71.75 v77.34,71.75
  Bottom 0.406: IC2.26 78.15,70.82 77.34,71.63 v77.34,71.75 | v83.69,65.91 83.69,67.18 82.3,68.58 82.3,80.9 81.15,82.04 SV6.1
N$63
  Bottom 0.406: IC2.57 76.55,36.99 76.96,36.58 80.26,36.58 80.77,36.07 80.77,33.4 SV1.4
N$64
  Bottom 0.406: IC2.30 81.35,60.9 83.57,63.12 86.23,63.12 86.23,69.09 90.68,69.09 MOTION_STOP.3
N$65
  Bottom 0.406: IC2.31 82.15,60.3 83.82,61.98 87,61.98 87,68.2 93.22,68.2 MOTION_STOP.2 93.34,74.3
N$66
  Bottom 0.406: IC2.32 82.95,59.58 84.45,61.09 88.01,61.09 88.01,67.06 95.76,67.06 MOTION_STOP.1 95.63,74.3
N$67
  Bottom 0.406: IC2.58 75.75,36.52 76.71,35.56 78.23,35.56 78.36,35.43 SV1.3
N$68
  Bottom 0.406: IC2.59 74.95,36.05 75.82,35.18 SV1.2
N$69
  Bottom 0.406: IC2.61 73.35,33.34 SV1.1
N$70
  Bottom 0.406: IC2.60 74.15,35.45 74.55,35.05 74.55,29.97 73.85,29.27 R1.2
N$71  (via drill 1.2 pad 1.78)
  Top 0.406: v62.74,59.94 62.74,62.36 63.75,63.37 65.66,63.37 66.17,63.88 66.17,69.98 66.93,70.74 69.22,70.74 69.72,71.25 69.72,76.07 69.22,76.58 66.17,76.58 v65.53,77.22
  Bottom 0.406: IC2.16 66.93,56.32 66.93,59.18 63.5,59.18 v62.74,59.94 | v65.53,77.22 65.53,77.98 63.88,79.63 63.88,81.53 63.5,81.92 57.66,81.92 SV3.4
N$72  (via drill 1.2 pad 1.78)
  Top 0.406: v58.67,48.64 58.29,49.02 58.29,56.13 59.18,57.02 59.18,65.41 61.09,67.31 61.09,70.74 61.47,71.12 63.75,71.12 64.64,72.01 64.64,73.15 60.45,77.34 58.17,77.34 v58.04,77.47
  Bottom 0.406: IC2.10 66.85,51.52 66.8,51.56 66.42,51.18 61.85,51.18 61.85,52.96 60.2,52.96 60.2,49.4 58.67,49.4 v58.67,48.64 | 58.04,77.34 v58.04,77.47 57.91,77.6 50.67,77.6 49.91,78.36 SV3.1
N$73
  Bottom 0.406: POTI.2 R1.1
N$76  (via drill 1.2 pad 1.78)
  Top 0.406: v59.82,40.77 59.05,40.77 58.29,41.53 58.29,44.07 59.05,44.83 59.82,44.83 60.2,45.21 60.2,46.86 60.96,47.62 60.96,65.02 62.74,66.8 62.74,69.6 64.26,69.6 66.42,71.75 66.42,74.17 62.36,78.23 62.36,78.99 62.99,79.63 v62.23,80.39
  Bottom 0.406: IC2.4 65.28,46.72 65.28,46.61 65.15,46.61 65.15,42.42 64.39,41.66 60.71,41.66 v59.82,40.77 | SV3.3 54.99,80.64 55.63,80.01 58.8,80.01 59.56,80.77 61.85,80.77 v62.23,80.39
N$79  (via drill 1.2 pad 1.78)
  Top 0.406: v91.19,49.15 91.19,49.91 94.11,52.83 94.87,52.83 95.38,53.34 95.38,59.18 95,59.56 v95,59.69
  Bottom 0.406: IC2.43 90.48,48.32 91.19,49.02 v91.19,49.15 | v95,59.69 SV4.3
N$80
  Bottom 0.406: IC2.34 85.98,55.52 85.98,59.18 89.92,59.18 89.92,62.23 SV4.2
N$81
  Bottom 0.406: IC2.33 84.75,59.73 85.09,60.07 89.03,60.07 89.03,64.77 SV4.1
N$82  (via drill 1.2 pad 1.78)
  Top 0.406: v62.87,44.2 62.87,43.31 63.75,42.42 92.96,42.42 93.09,42.55 93.22,42.55 93.34,42.67 99.57,42.67 100.08,43.18 100.08,55.37 100.97,56.26 105.03,56.26 105.66,55.63 v105.66,51.44
  Bottom 0.406: IC2.6 68,48.32 67.82,48.13 63.25,48.13 63.25,44.58 v62.87,44.2 | v105.66,51.44 MOTION_RIGHT.4
PB7  (via drill 1.2 pad 1.78)
  Top 0.406: v64.26,61.59 68.58,61.59 71.12,64.14 71.12,74.68 72.39,75.95 v72.39,77.47
  Bottom 0.406: IC2.17 69.22,58.12 69.22,57.15 67.82,57.15 67.82,60.07 65.79,60.07 v64.26,61.59 | v72.39,77.47 71.75,77.47 70.61,78.61 67.56,78.61 66.42,79.76 SV6.5
PG3  (via drill 1.2 pad 1.78)
  Top 0.406: v69.22,59.94 69.22,60.33 72.39,63.5 72.39,73.53 74.3,75.44 74.55,75.44 74.93,75.82 v74.93,77.34
  Bottom 0.406: IC2.18 71.75,59.31 69.22,59.31 v69.22,59.94 | 74.8,77.47 v74.93,77.34 72.52,79.76 70.48,79.76 68.96,81.28 SV6.4
PG4  (via drill 1.2 pad 1.78)
  Top 0.406: v71.88,60.83 72.39,60.83 73.28,61.72 73.28,73.28 74.42,74.42 76.96,74.42 77.6,75.06 77.6,77.22 v77.47,77.34
  Bottom 0.406: IC2.19 72.55,60.17 72.01,60.71 71.88,60.71 v71.88,60.83 | 77.34,77.47 v77.47,77.34 77.6,77.47 77.6,78.87 77.22,79.25 74.3,79.25 SV6.3
PWM_SERVO  (via drill 1.2 pad 1.78)
  Top 0.406: v59.18,29.34 59.05,29.34 59.05,32.13 60.71,33.78 62.36,33.78 62.61,34.04 62.61,36.58 60.83,38.35 58.29,38.35 57.15,39.5 57.15,57.4 v57.53,57.78
  Bottom 0.406: 59.31,29.34 SERVO.2 | 59.31,29.34 59.18,29.46 | v59.18,29.34 59.31,29.34 | IC2.15 66.17,55.52 66.17,58.42 57.53,58.42 v57.53,57.78
RST  (via drill 1.2)
  Top 0.406: v42.42,53.09 37.85,53.09 37.47,52.7 v37.47,52.07
  Bottom 0.406: 51.69,59.05 51.65,59.05 R2.1 | R2.1 arc-90 51.64,59.05 | R2.1 51.65,59.03 C6.2 47.24,59.03 47.24,54.61 | 47.24,54.61 51.47,54.61 IC4.17 51.47,45.34 53.98,45.34 53.98,53.21 56.13,53.21 56.13,62.1 58.93,64.9 58.93,66.17 59.18,66.42 62.74,66.42 65.66,63.5 65.66,62.36 66.67,61.34 69.34,61.34 71.12,63.12 71.12,64.77 73.41,64.77 73.41,64.64 73.35,64.64 IC2.20 | ISP.5 36.92,44.92 37.59,45.59 37.59,51.94 v37.47,52.07 | 47.24,54.61 42.8,54.61 42.42,54.23 v42.42,53.09
RXD
  Bottom 0.406: IC6.12 33.66,71.69 33.66,70.23 36.83,70.23 JP1.3
RXD1  (via drill 1.2 pad 1.78)
  Top 0.406: v32.13,75.95 34.54,75.95 35.69,74.8 60.83,74.8 v63.12,72.52
  Bottom 0.406: IC2.27 78.87,58.12 78.87,73.28 63.25,73.28 63.25,72.39 63.12,72.39 v63.12,72.52 | IC6.9 32.13,75.5 v32.13,75.95
SCK  (via drill 1.2)
  Top 0.406: v34.67,47.37 45.63,47.37 46.39,48.13 46.39,51.02 v46.35,51.05
  Bottom 0.406: IC2.11 66.04,52.32 66.04,52.2 62.61,52.2 62.61,54.99 61.47,54.99 61.47,53.85 59.44,53.85 59.44,50.16 57.28,50.16 57.28,43.43 56.26,42.42 46.86,42.42 46.39,42.89 IC4.13 | IC4.13 46.35,47.18 | R4.2 34.59,47.45 v34.67,47.37 | IC4.13 46.39,51.02 v46.35,51.05
TXD
  Bottom 0.406: IC6.11 36.83,72.96 JP1.1
TXD1
  Bottom 0.406: IC6.10 79.75,74.23 IC2.28
VCC  (via drill 1.2)
  Top 0.406: v84.07,23.5 83.95,23.37 56.9,23.37 56.39,23.88 56.39,33.27 56.64,33.53 | v49.53,33.53 56.64,33.53 | 56.64,33.53 58.67,33.53 59.05,33.91 v59.05,36.7 56.26,36.7 56.01,36.96 v56.01,66.8
  Bottom 0.406: 31.75,66.55 31.75,66.46 C23.1 31.79,66.55 31.75,66.55 | 31.75,66.61 31.75,66.55 | 30.23,66.61 30.23,66.67 | C5.2 53.98,57.28 53.98,57.27 | C5.2 53.98,57.27 | C5.2 54.01,57.28 | 53.98,57.16 R2.2 | 53.98,57.16 53.98,57.27 | 47.62,28.19 47.62,37.38 IC4.6 IC4.5 IC4.4 48.93,34.12 v49.53,33.53 | 53.98,57.16 54.01,57.16 54.01,54.48 | 54.01,54.48 55.12,54.48 55.12,59.94 55.24,60.07 55.24,62.61 58.17,65.53 58.17,66.67 58.8,67.31 63.25,67.31 64.52,66.04 64.52,65.66 65.15,65.02 66.04,65.02 66.29,64.77 66.29,62.99 67.06,62.23 68.96,62.23 70.36,63.63 70.36,65.53 70.48,65.66 72.14,65.66 72.14,66.8 74.17,66.8 74.17,58.12 | 54.01,54.48 52.74,54.48 IC4.18 | 74.17,58.12 IC2.21 | 74.17,44.83 74.17,58.12 | 74.17,44.83 70.95,44.83 IC2.64 70.95,41.27 69.09,41.27 68.71,40.89 68.71,38.1 67.78,37.17 67.78,36.96 | 74.17,44.83 80.52,44.83 80.55,44.8 IC2.52 | 67.82,36.66 C1.2 67.78,36.96 | C15.+ 96.27,20.19 95.76,20.7 84.64,20.7 84.64,22.92 v84.07,23.5 84.07,26.04 83.31,26.8 71.37,26.8 70.61,27.56 67.18,27.56 66.67,28.07 66.67,30.99 | v59.05,36.7 59.1,36.66 R3.2 66.75,36.66 67.06,36.96 67.78,36.96 | v56.01,66.8 56.01,67.31 57.28,68.58 ISP1.7 | 37.72,24.14 38.59,24.14 F2.P$2 | POTI.3 66.93,31.37 66.67,31.11 66.67,30.99 | SERVO.3 65.79,31.88 66.67,30.99
  Bottom 0.813: 30.23,66.61 31.75,66.61 | 30.23,66.61 IC6.16 | 38.61,28.19 33.4,28.19 32.13,29.46 22.55,29.46 ISP.2 19.3,39.84 19.3,58.55 30.23,58.55 30.23,66.61 | 59.94,72.39 ISP1.10 ISP1.8 | ISP1.4 ISP1.2 | ISP1.6 ISP1.4 | ISP1.8 ISP1.6 | ISP1.1 49.53,69.85 | ISP1.3 ISP1.1 | ISP1.5 ISP1.3 | ISP1.7 ISP1.5 | ISP1.7 ISP1.9 | ISP1.2 49.66,72.52 49.78,72.52 | ISP1.1 ISP1.2 | ISP1.3 ISP1.4 | ISP1.5 ISP1.6 | ISP1.7 57.28,69.72 | ISP1.7 ISP1.8 | IC5.3 37.72,24.14 37.72,24 | 38.61,28.19 F2.P$2 | 38.61,28.19 47.62,28.19 | IC1.4 112.09,5.41 112.78,6.1 116.59,6.1 118.87,8.38 118.87,20.7 106.05,20.7 103,17.65 L1.P$2 97.92,17.65 C15.+

### Text on the board
Top: STOP | LEFT | RIGHT | POTI | SERVO